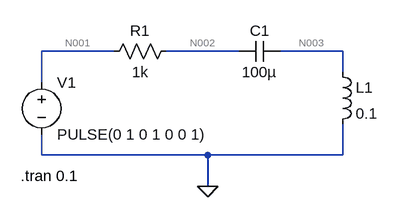
[diagram p0: schematic RLC_circuit.asc]
RLC_circuit.asc, the LTspice schematic file:
Version 4
SHEET 1 880 680
WIRE 208 80 96 80
WIRE 400 80 288 80
WIRE 560 80 464 80
WIRE 560 112 560 80
WIRE 96 128 96 80
WIRE 96 240 96 208
WIRE 352 240 96 240
WIRE 560 240 560 192
WIRE 560 240 352 240
WIRE 352 288 352 240
FLAG 352 288 0
SYMBOL voltage 96 112 R0
WINDOW 123 0 0 Left 0
WINDOW 39 0 0 Left 0
SYMATTR InstName V1
SYMATTR Value PULSE(0 1 0 1 0 0 1)
SYMBOL res 304 64 R90
WINDOW 0 0 56 VBottom 2
WINDOW 3 32 56 VTop 2
SYMATTR InstName R1
SYMATTR Value 1k
SYMBOL cap 464 64 R90
WINDOW 0 0 32 VBottom 2
WINDOW 3 32 32 VTop 2
SYMATTR InstName C1
SYMATTR Value 100µ
SYMBOL ind 544 96 R0
SYMATTR InstName L1
SYMATTR Value 0.1
TEXT 64 272 Left 2 !.tran 0.1

The netlist it stands for:
* RLC_circuit.asc
V1 N001 0 PULSE(0 1 0 1 0 0 1)
R1 N002 N001 1k
C1 N003 N002 100µ
L1 N003 0 0.1
.tran 0.1
.backanno
.end

* Results of the author's LTspice run, read from the files saved beside the schematic
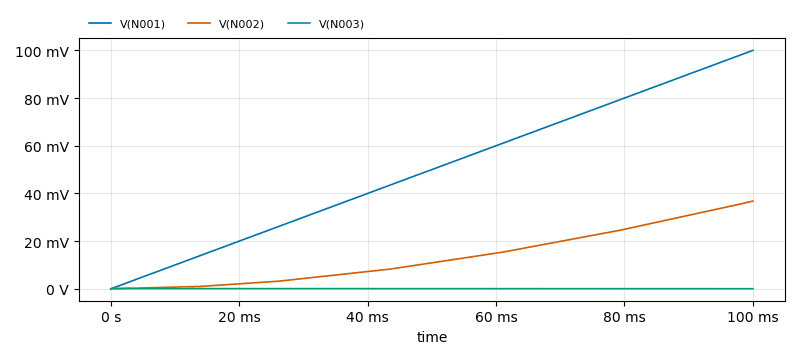
[diagram p1: Transient Analysis of RLC_circuit.asc, plotted from the saved traces]
* Transient Analysis, 1 run:
*   V(N001): min 0 V, max 100 mV, average 50 mV, rms 58.12 mV, last 100 mV
*   V(N002): min 0 V, max 36.79 mV, average 13.38 mV, rms 17.64 mV, last 36.79 mV
*   V(N003): min 0 V, max 99.69 µV, average 63.37 µV, rms 66.02 µV, last 36.89 µV